# Altium schematic sheet relays.SchDoc
size A
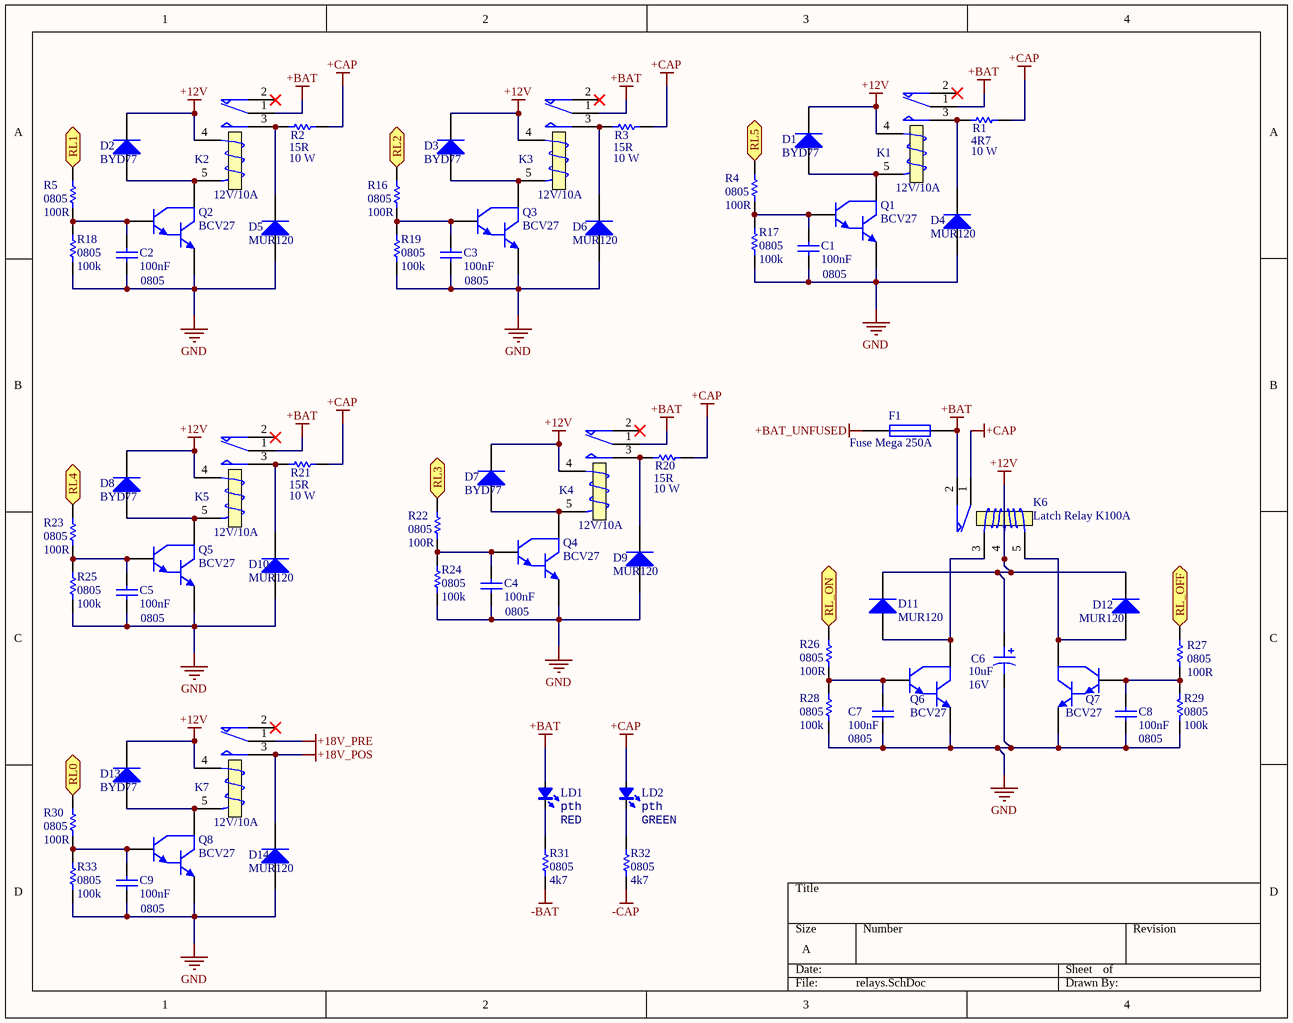
[diagram p0: relays.SchDoc]

## Parts
C1  100nF  Footprint: 0805  [0805C]
C2  100nF  Footprint: 0805  [0805C]
C3  100nF  Footprint: 0805  [0805C]
C4  100nF  Footprint: 0805  [0805C]
C5  100nF  Footprint: 0805  [0805C]
C6  Voltage: 16V  [CP3.5mm-8.0mm]  (hidden comment: 10uF)
C7  100nF  Footprint: 0805  [0805C]
C8  100nF  Footprint: 0805  [0805C]
C9  100nF  Footprint: 0805  [0805C]
D1  BYD77  [DIO10.2-7x2.7]
D2  BYD77  [DIO10.2-7x2.7]
D3  BYD77  [DIO10.2-7x2.7]
D4  MUR120  [DSO-C2/X2.3]
D5  MUR120  [DSO-C2/X2.3]
D6  MUR120  [DSO-C2/X2.3]
D7  BYD77  [DIO10.2-7x2.7]
D8  BYD77  [DIO10.2-7x2.7]
D9  MUR120  [DSO-C2/X2.3]
D10  MUR120  [DSO-C2/X2.3]
D11  MUR120  [DIO10.2-7x2.7]
D12  MUR120  [DIO10.2-7x2.7]
D13  BYD77  [DIO10.2-7x2.7]
D14  MUR120  [DSO-C2/X2.3]
F1  Fuse Mega 250A  [FuseANL]
K1  12V/10A  [RELE]
K2  12V/10A  [RELE]
K3  12V/10A  [RELE]
K4  12V/10A  [RELE]
K5  12V/10A  [RELE]
K6  Latch Relay K100A  [K100A]
K7  12V/10A  [RELE]
LD1  Type: pth  [LED3MM]  (hidden comment: RED)
LD2  Type: pth  [LED3MM]  (hidden comment: GREEN)
Q1  BCV27  [SOT95P240-3N]
Q2  BCV27  [SOT95P240-3N]
Q3  BCV27  [SOT95P240-3N]
Q4  BCV27  [SOT95P240-3N]
Q5  BCV27  [SOT95P240-3N]
Q6  BCV27  [SOT95P240-3N]
Q7  BCV27  [SOT95P240-3N]
Q8  BCV27  [SOT95P240-3N]
R1  4R7  Power: 10 W  [R-AC10]
R2  15R  Power: 10 W  [R-AC10]
R3  15R  Power: 10 W  [R-AC10]
R4  0805  value 100R  [0805R]
R5  0805  value 100R  [0805R]
R16  0805  value 100R  [0805R]
R17  0805  value 100k  [0805R]
R18  0805  value 100k  [0805R]
R19  0805  value 100k  [0805R]
R20  15R  Power: 10 W  [R-AC10]
R21  15R  Power: 10 W  [R-AC10]
R22  0805  value 100R  [0805R]
R23  0805  value 100R  [0805R]
R24  0805  value 100k  [0805R]
R25  0805  value 100k  [0805R]
R26  0805  value 100R  [0805R]
R27  0805  value 100R  [0805R]
R28  0805  value 100k  [0805R]
R29  0805  value 100k  [0805R]
R30  0805  value 100R  [0805R]
R31  0805  value 4k7  [0805R]
R32  0805  value 4k7  [0805R]
R33  0805  value 100k  [0805R]

## Ports
RL0 (in), RL1 (in), RL2 (in), RL3 (in), RL4 (in), RL5 (in), RL_OFF (in), RL_ON (in)

## Nets
+12V: C6.1 D1.2(K) D2.2(K) D3.2(K) D7.2(K) D8.2(K) D11.2(K) D12.2(K) D13.2(K) K1.4(T1) K2.4(T1) K3.4(T1) K4.4(T1) K5.4(T1) K6.4(T2) K7.4(T1)
+18V_POS: D14.2(K) K7.3(NO)
+18V_PRE: K7.1(COM)
+BAT: F1.2 K1.1(COM) K2.1(COM) K3.1(COM) K4.1(COM) K5.1(COM) K6.2(NC) LD1.1(A)
+BAT_UNFUSED: F1.1
+CAP: K6.1(COM) LD2.1(A) R1.1 R2.1 R3.1 R20.1 R21.1
-BAT: R31.1
-CAP: R32.1
GND: C1.1 C2.1 C3.1 C4.1 C5.1 C6.2 C7.1 C8.1 C9.1 D4.1(A) D5.1(A) D6.1(A) D9.1(A) D10.1(A) D14.1(A) Q1.3(E) Q2.3(E) Q3.3(E) Q4.3(E) Q5.3(E) Q6.3(E) Q7.3(E) Q8.3(E) R17.1 R18.1 R19.1 R24.1 R25.1 R28.1 R29.1 R33.1
RL0: R30.2 ; port RL0
RL1: R5.2 ; port RL1
RL2: R16.2 ; port RL2
RL3: R22.2 ; port RL3
RL4: R23.2 ; port RL4
RL5: R4.2 ; port RL5
RL_OFF: R27.2 ; port RL_OFF
RL_ON: R26.2 ; port RL_ON
NetC1_2: C1.2 Q1.2(B) R4.1 R17.2
NetC2_2: C2.2 Q2.2(B) R5.1 R18.2
NetC3_2: C3.2 Q3.2(B) R16.1 R19.2
NetC4_2: C4.2 Q4.2(B) R22.1 R24.2
NetC5_2: C5.2 Q5.2(B) R23.1 R25.2
NetC7_2: C7.2 Q6.2(B) R26.1 R28.2
NetC8_2: C8.2 Q7.2(B) R27.1 R29.2
NetC9_2: C9.2 Q8.2(B) R30.1 R33.2
NetD1_1: D1.1(A) K1.5(T2) Q1.1(C)
NetD2_1: D2.1(A) K2.5(T2) Q2.1(C)
NetD3_1: D3.1(A) K3.5(T2) Q3.1(C)
NetD4_2: D4.2(K) K1.3(NO) R1.2
NetD5_2: D5.2(K) K2.3(NO) R2.2
NetD6_2: D6.2(K) K3.3(NO) R3.2
NetD7_1: D7.1(A) K4.5(T2) Q4.1(C)
NetD8_1: D8.1(A) K5.5(T2) Q5.1(C)
NetD9_2: D9.2(K) K4.3(NO) R20.2
NetD10_2: D10.2(K) K5.3(NO) R21.2
NetD11_1: D11.1(A) K6.3(T1) Q6.1(C)
NetD12_1: D12.1(A) K6.5(T3) Q7.1(C)
NetD13_1: D13.1(A) K7.5(T2) Q8.1(C)
NetLD1_2: LD1.2(K) R31.2
NetLD2_2: LD2.2(K) R32.2

Not connected (* = marked no-connect by the designer): K1 2(NC)*; K2 2(NC)*; K3 2(NC)*; K4 2(NC)*; K5 2(NC)*; K7 2(NC)*

## Library data of the parts
C1-C5 C7-C9 = Cap: Capacitor; Voltage: 25V; Type: pth; Value: 100nF
C6 = CapacitorPol: Solid Aluminum Capacitor with Organic Semiconductor Electrolyte: 100uF, 10V, Bulk Pack; Type: pth; Value: 10uF
D1-D14 = Diode: Default Diode; Type: pth
  D1-D3 D7 D8 D13: Value: BYD77
  D4-D6 D9-D12 D14: Value: MUR120
F1 = Fuse 1: Fuse; Type: MEGA / ANL; Value: 250A
K1-K7 = Relay: SPDT Relay; Value: KRE 3; Type: KRE
LD1 LD2 = LED_0805: LED
  LD1: Value: RED
  LD2: Value: GREEN
Q1-Q8 = NPN1: NPN Darlington Bipolar Transistor; Value: BCV27
R1-R3 R20 R21 = ResistorPower: Power Resistor; Tolerance: 5%; Value: 15R 10W; Type: pth
R4 R5 R16-R19 R22-R33 = Res1: Resistor; Type: 0805